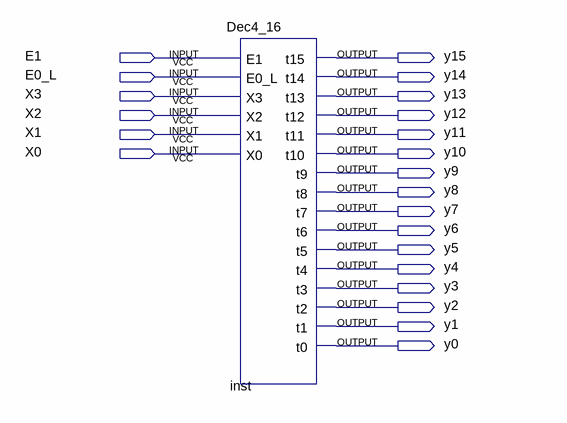
[diagram p0: schematic sheet]
// Quartus schematic DecoderDemo2.bdf as structural Verilog: 1 symbols, 22 pins
module DecoderDemo2 (
  input  E1,
  input  E0_L,
  input  X3,
  input  X2,
  input  X1,
  input  X0,
  output y15,
  output y14,
  output y13,
  output y12,
  output y11,
  output y10,
  output y9,
  output y8,
  output y7,
  output y6,
  output y5,
  output y4,
  output y3,
  output y2,
  output y1,
  output y0
);

  Dec4_16 inst (
    .E1(E1), .E0_L(E0_L), .X3(X3), .X2(X2), .X1(X1), .X0(X0), .t15(y15), .t14(y14), .t13(y13), .t12(y12),
    .t11(y11), .t10(y10), .t9(y9), .t8(y8), .t7(y7), .t6(y6), .t5(y5), .t4(y4), .t3(y3), .t2(y2), .t1(y1),
    .t0(y0));
endmodule
